# EAGLE schematic Sensor (EAGLE 6.3)
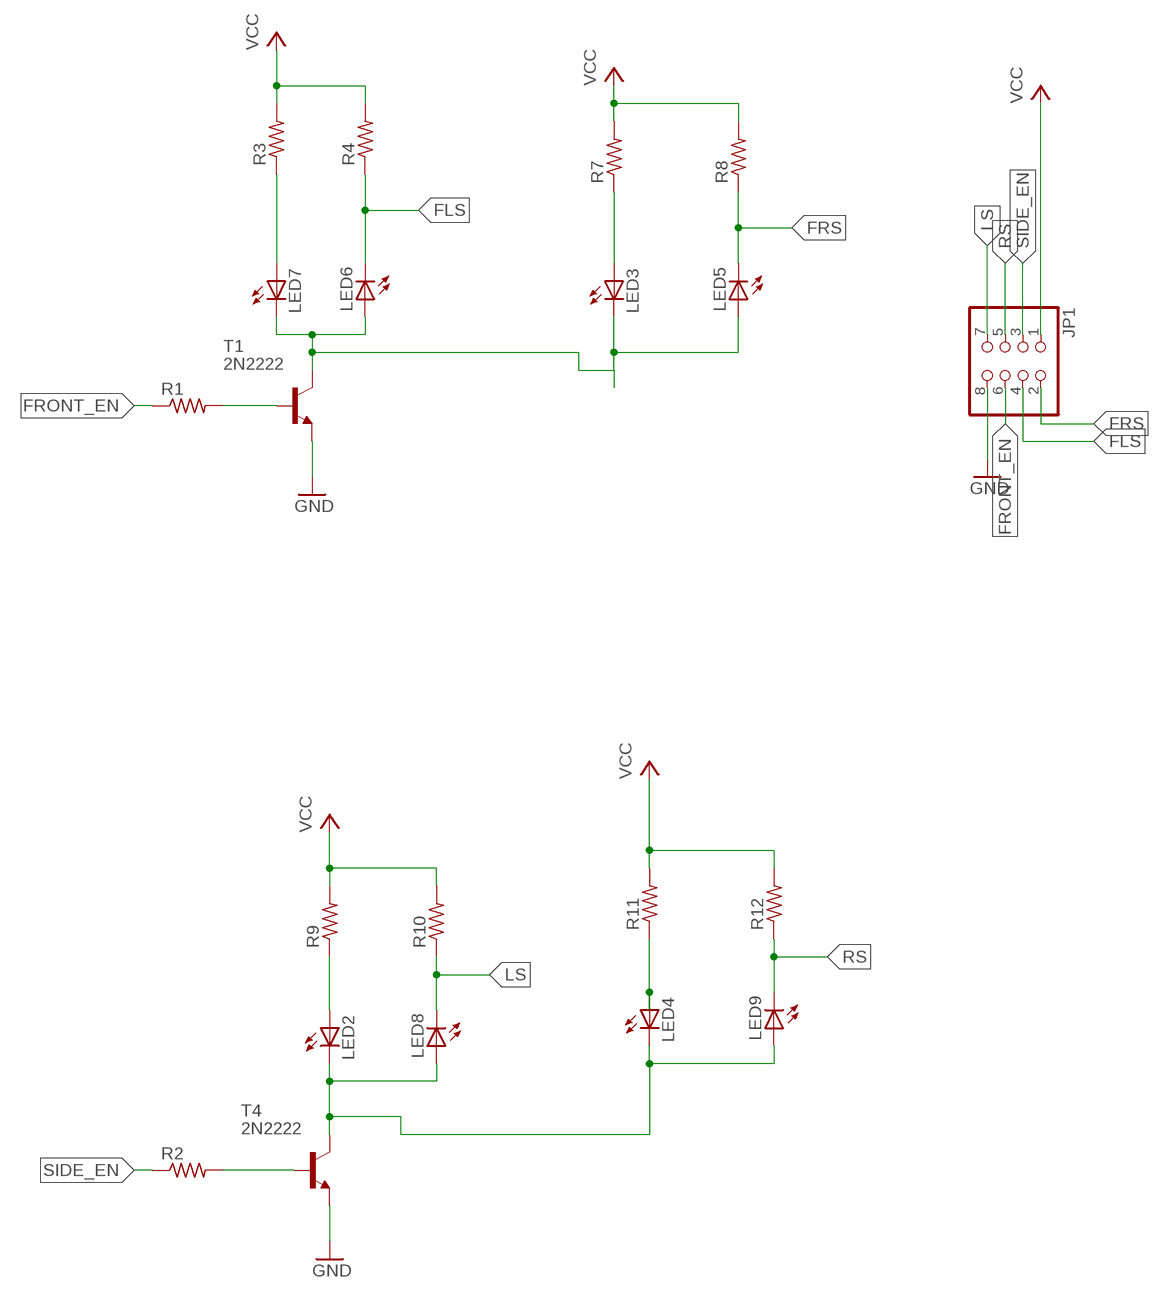
[diagram p0: schematic, sheet 1]

## Parts
JP1  PINHD-2X4  [2X04]
LED2  LED5MM  [LED5MM]
LED3  LED5MM  [LED5MM]
LED4  LED5MM  [LED5MM]
LED5  LED5MM  [LED5MM]
LED6  LED5MM  [LED5MM]
LED7  LED5MM  [LED5MM]
LED8  LED5MM  [LED5MM]
LED9  LED5MM  [LED5MM]
R1  R-US_R0805  [R0805]
R2  R-US_R0805  [R0805]
R3  R-US_R0805  [R0805]
R4  R-US_R0805  [R0805]
R7  R-US_R0805  [R0805]
R8  R-US_R0805  [R0805]
R9  R-US_R0805  [R0805]
R10  R-US_R0805  [R0805]
R11  R-US_R0805  [R0805]
R12  R-US_R0805  [R0805]
T1  2N2222  [TO92-EBC-OVAL]
T4  2N2222  [TO92-EBC-OVAL]

## Nets
FLS: JP1.4 LED6.K(C) R4.1
FRONT_EN: JP1.6 R1.1
FRS: JP1.2 LED5.K(C) R8.1
GND: JP1.8 T1.E T4.E
LS: JP1.7 LED8.K(C) R10.1
N$1: LED7.A R3.1
N$2: R1.2 T1.B
N$3: LED3.K(C) LED5.A LED6.A LED7.K(C) T1.C
N$5: R2.2 T4.B
N$6: LED2.K(C) LED4.K(C) LED8.A LED9.A T4.C
N$7: LED3.A R7.1
N$10: LED2.A R9.1
N$11: LED4.A R11.1
RS: JP1.5 LED9.K(C) R12.1
SIDE_EN: JP1.3 R2.1
VCC: JP1.1 R3.2 R4.2 R7.2 R8.2 R9.2 R10.2 R11.2 R12.2

## Library data of the parts
JP1 = adafruit:PINHD-2X4: PIN HEADER
LED2-LED9 = adafruit:LED: LED OSRAM: - CHIPLED LG R971, LG N971, LY N971, LG Q971, LY Q971, LO R971, LY R971 LH N974, LH R974 LS Q976, LO Q976, LY Q976 LO Q996 - Hyper CHIPLED LW Q18S LB Q993, LB Q99A, LB R99A - SideLED LS A670, LO A670, LY A670, LG A670, LP A670 LB A673, LV A673, LT A673, LW A673 LH A674 LY A675 LS A676, LA A676, LO A676, LY A676, LW A676 LS A679, LY A679, LG A679 - Hyper Micro SIDELED® LS Y876, LA Y876, LO Y876, LY Y876 LT Y87S - SmartLED LW L88C, LW L88S LB L89C, LB L89S, LG L890 LS L89K, LO L89K, LY L89K LS L896, LA L896, LO L896, LY L896 - TOPLED LS T670, LO T670, LY T670, LG T670, LP T670 LSG T670, LSP T670, LSY T670, LOP T670, LYG T670 LG T671, LOG T671, LSG T671 LB T673, LV T673, LT T673, LW T673 LH T674 LS T676, LA T676, LO T676, LY T676, LB T676, LH T676, LSB T676, LW T676 LB T67C, LV T67C, LT T67C, LS T67K, LO T67K, LY T67K, LW E67C LS E67B, LA E67B, LO E67B, LY E67B, LB E67C, LV E67C, LT E67C LW T67C LS T679, LY T679, LG T679 LS T770, LO T770, LY T770, LG T770, LP T770 LB T773, LV T773, LT T773, LW T773 LH T774 LS E675, LA E675, LY E675, LS T675 LS T776, LA T776, LO T776, LY T776, LB T776 LHGB T686 LT T68C, LB T68C - Hyper Mini TOPLED® LB M676 - Mini TOPLED Santana® LG M470 LS M47K, LO M47K, LY M47K Source: http://www.osram.convergy.de/
R1-R4 R7-R12 = adafruit:R-US_: RESISTOR, American symbol
T1 T4 = adafruit:2N2222: NPN TRANSISTOR Big oval pads